# EAGLE schematic CocoBra (EAGLE 6.3)
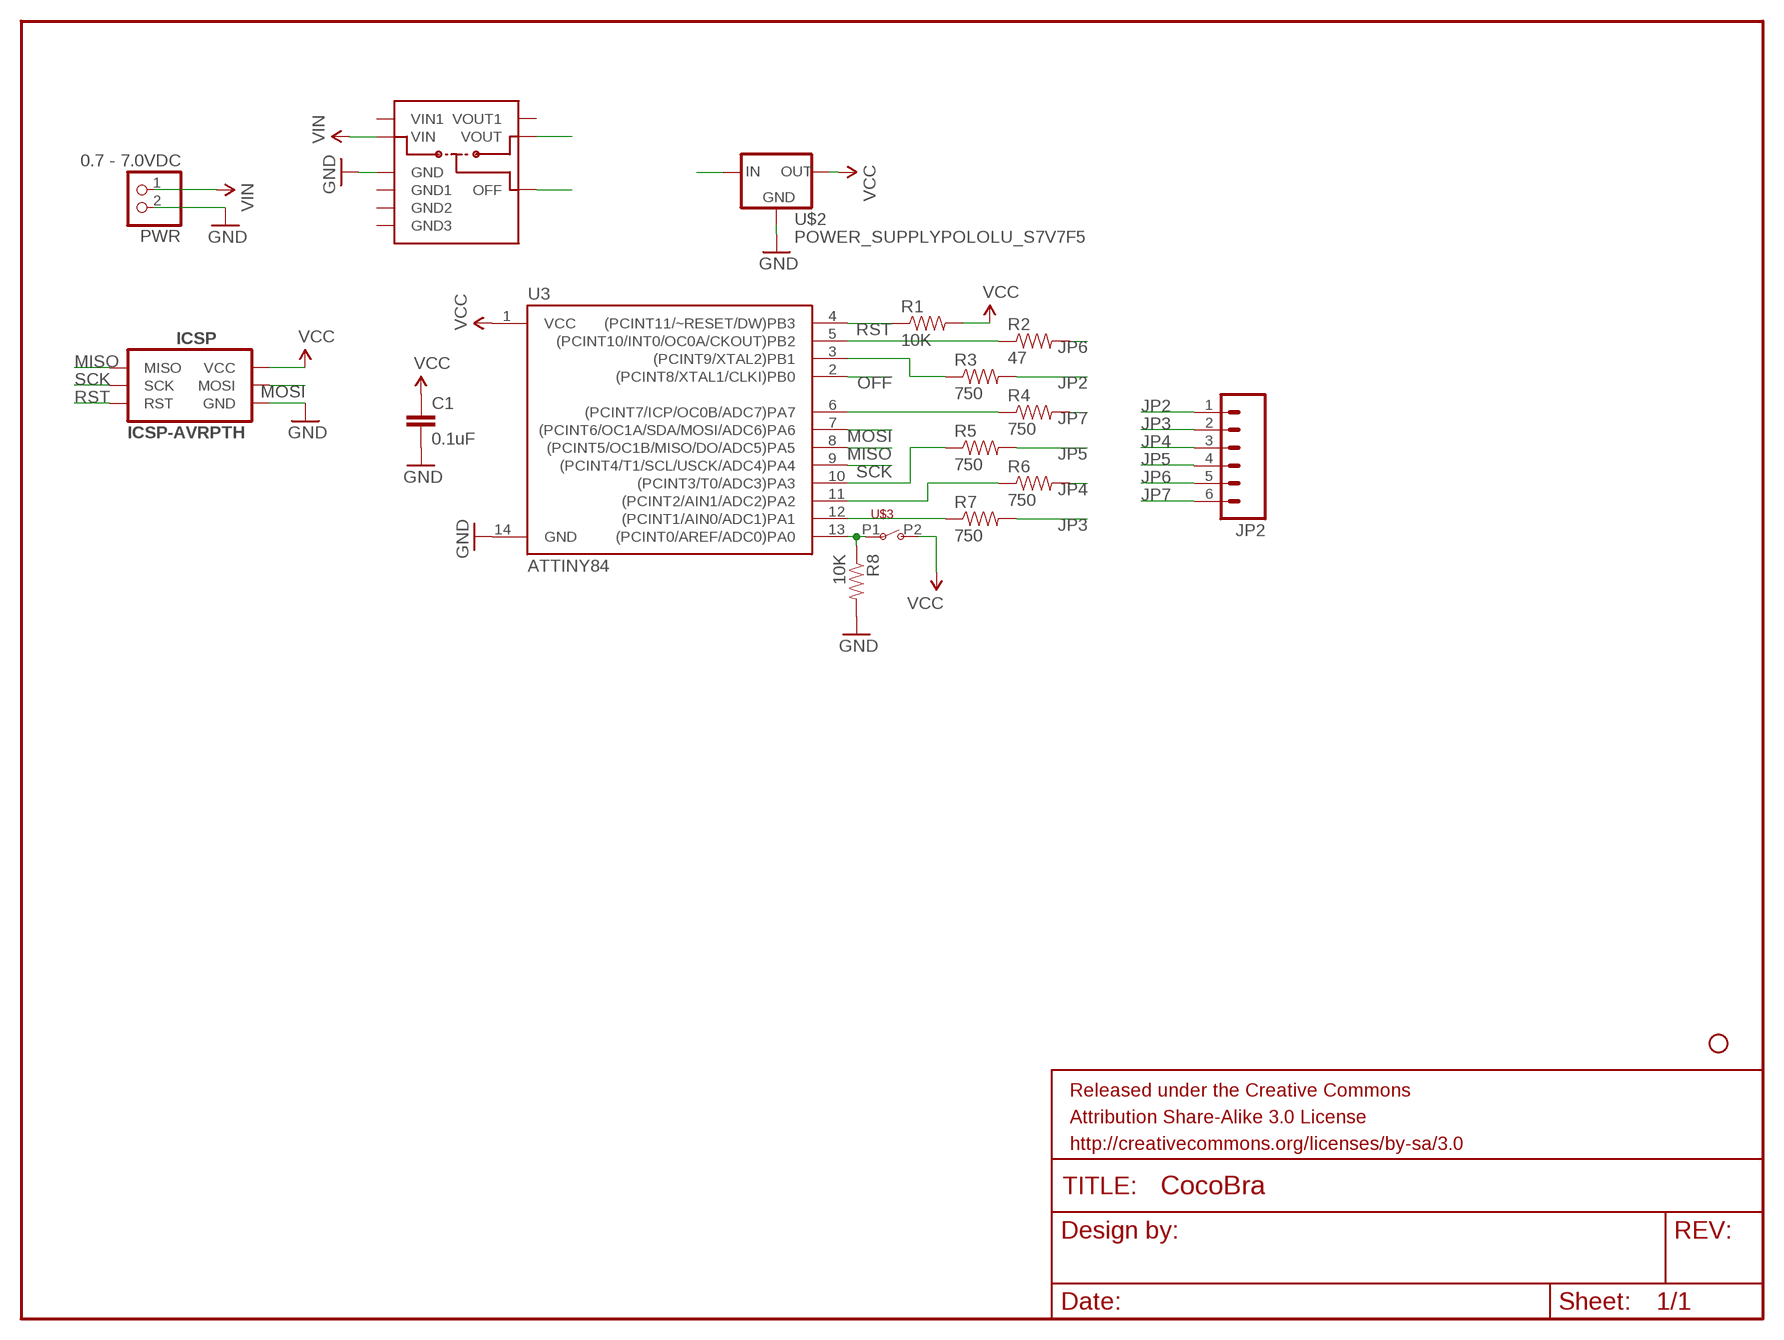
[diagram p0: schematic, sheet 1]

## Parts
C1  0.1uF  CAPPTH2  [CAP-PTH-SMALL2]
FRAME1  FRAME-LETTER  [CREATIVE_COMMONS]
ICSP  ICSP-AVRPTH  [2X3-SHROUDED]
JP2  M06SIP  [1X06]
PWR  0.7 - 7.0VDC  JST_2PIN-THM-RA  [JST-PH-2-THM-RA]
R1  10K  RESISTORAXIAL-0.2  [AXIAL-0.2]
R2  47  RESISTORAXIAL-0.3  [AXIAL-0.3]
R3  750  RESISTORAXIAL-0.3  [AXIAL-0.3]
R4  750  RESISTORAXIAL-0.3  [AXIAL-0.3]
R5  750  RESISTORAXIAL-0.3  [AXIAL-0.3]
R6  750  RESISTORAXIAL-0.3  [AXIAL-0.3]
R7  750  RESISTORAXIAL-0.3  [AXIAL-0.3]
R8  10K  RESISTORAXIAL-0.2  [AXIAL-0.2]
STANDOFF3  STAND-OFF#2  [STAND-OFF-#2]
U3  ATTINY84  ATTINY84DIL14  [DIL14]
U$2  POWER_SUPPLYPOLOLU_S7V7F5  [POLOLU_POWER_SUPPLY_S7V7F5]
U$3  SWITCH-SPSTTILT  [SWITCH-SPST-TILT]
U$4  POLOLU_POWER_SWITCHPTH  [POLOLU_POWER_SWITCH]

## Nets
GND [power]: C1.2 ICSP.6(GND) PWR.2 R8.P$2 U3.14(GND) U$2.GND U$4.GND
JP2: JP2.1 R3.P$2
JP3: JP2.2 R7.P$2
JP4: JP2.3 R6.P$2
JP5: JP2.4 R5.P$2
JP6: JP2.5 R2.P$2
JP7: JP2.6 R4.P$2
MISO: ICSP.1(MISO) U3.8((PCINT5/OC1B/MISO/DO/ADC5)PA5)
MOSI: ICSP.4(MOSI) U3.7((PCINT6/OC1A/SDA/MOSI/ADC6)PA6)
N$1: R2.P$1 U3.5((PCINT10/INT0/OC0A/CKOUT)PB2)
N$2: R3.P$1 U3.3((PCINT9/XTAL2)PB1)
N$3: R4.P$1 U3.6((PCINT7/ICP/OC0B/ADC7)PA7)
N$4: R5.P$1 U3.10((PCINT3/T0/ADC3)PA3)
N$5: R6.P$1 U3.11((PCINT2/AIN1/ADC2)PA2)
N$6: R7.P$1 U3.12((PCINT1/AIN0/ADC1)PA1)
N$7: R8.P$1 U3.13((PCINT0/AREF/ADC0)PA0) U$3.P1
OFF: U3.2((PCINT8/XTAL1/CLKI)PB0) U$4.OFF
RST: ICSP.5(RST) R1.P$1 U3.4((PCINT11/~RESET/DW)PB3)
SCK: ICSP.3(SCK) U3.9((PCINT4/T1/SCL/USCK/ADC4)PA4)
VCC: C1.1 ICSP.2(VCC) R1.P$2 U3.1(VCC) U$2.VOUT(OUT) U$3.P2
VIN [power]: PWR.1 U$4.VIN
VOUT: U$2.VIN(IN) U$4.VOUT
Unconnected: U$4.GND1 U$4.GND2 U$4.GND3 U$4.VIN1 U$4.VOUT1

## Library data of the parts
C1 = Dek:CAP: Capacitor Standard 0603 ceramic capacitor, and 0.1" leaded capacitor.
FRAME1 = SparkFun-Aesthetics:FRAME-LETTER: Schematic Frame Standard 8.5x11 US Letter frame
ICSP = Dek:ICSP-AVR
JP2 = SparkFun-Connectors:M06: Header 6 Standard 6-pin 0.1" header. Use with straight break away headers (SKU : PRT-00116), right angle break away headers (PRT-00553), swiss pins (PRT-00743), machine pins (PRT-00117), and female headers (PRT-00115). Molex polarized connector foot print use with SKU : PRT-08094 with associated crimp pins and housings. NOTES ON THE VARIANTS LOCK and LOCK_LONGPADS... This footprint was designed to help hold the alignment of a through-hole component (i.e. 6-pin header) while soldering it into place. You may notice that each hole has been shifted either up or down by 0.005 of an inch from it's more standard position (which is a perfectly straight line). This slight alteration caused the pins (the squares in the middle) to touch the edges of the holes. Because they are alternating, it causes a "brace" to hold the component in place. 0.005 has proven to be the perfect amount of "off-center" position when using our standard breakaway headers. Although looks a little odd when you look at the bare footprint, once you have a header in there, the alteration is very hard to notice. Also, if you push a header all the way into place, it is covered up entirely on the bottom side. This idea of altering the position of holes to aid alignment will be further integrated into the Sparkfun Library for other footprints. It can help hold any component with 3 or more connection pins.
PWR = Dek:JST_2PIN: JST 2-Pin Connectors of various flavors SMT-RA (S2B-PH-SM4) 4UConnector #17311 SMT (B2B-PH-SM4) THM-RA (S2B-PH) THM (B2B-PH)
R1-R8 = Dek:RESISTOR: Resistor Basic schematic elements and footprints for 0603, 1206, and PTH resistors.
STANDOFF3 = Dek:STAND-OFF: Stand Off This is the mechanical footprint for a #2 phillips button head screw. Use the keepout ring to avoid running the screw head into surrounding components.
U3 = Dek:ATTINY84: Atmel 14-pin 2/4/8kB flash uC
U$2 = Dek:POWER_SUPPLY
U$3 = Dek:SWITCH-SPST
U$4 = Dek:POLOLU_POWER_SWITCH

## Net classes
1 power: width 0.305 mm, clearance 0.305 mm